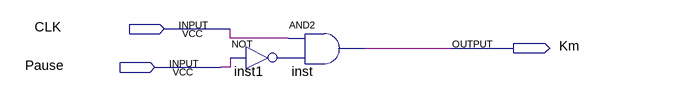
[diagram p0: schematic sheet]
// Quartus schematic clock.bdf as structural Verilog: 2 symbols, 3 pins
module clock (
  input  CLK,
  input  Pause,
  output Km
);

  wire inst1_out;

  not inst1 (inst1_out, Pause);
  and inst (Km, CLK, inst1_out);
endmodule
